# EAGLE schematic Analog_Teil - Kopie (EAGLE 9.3.2)
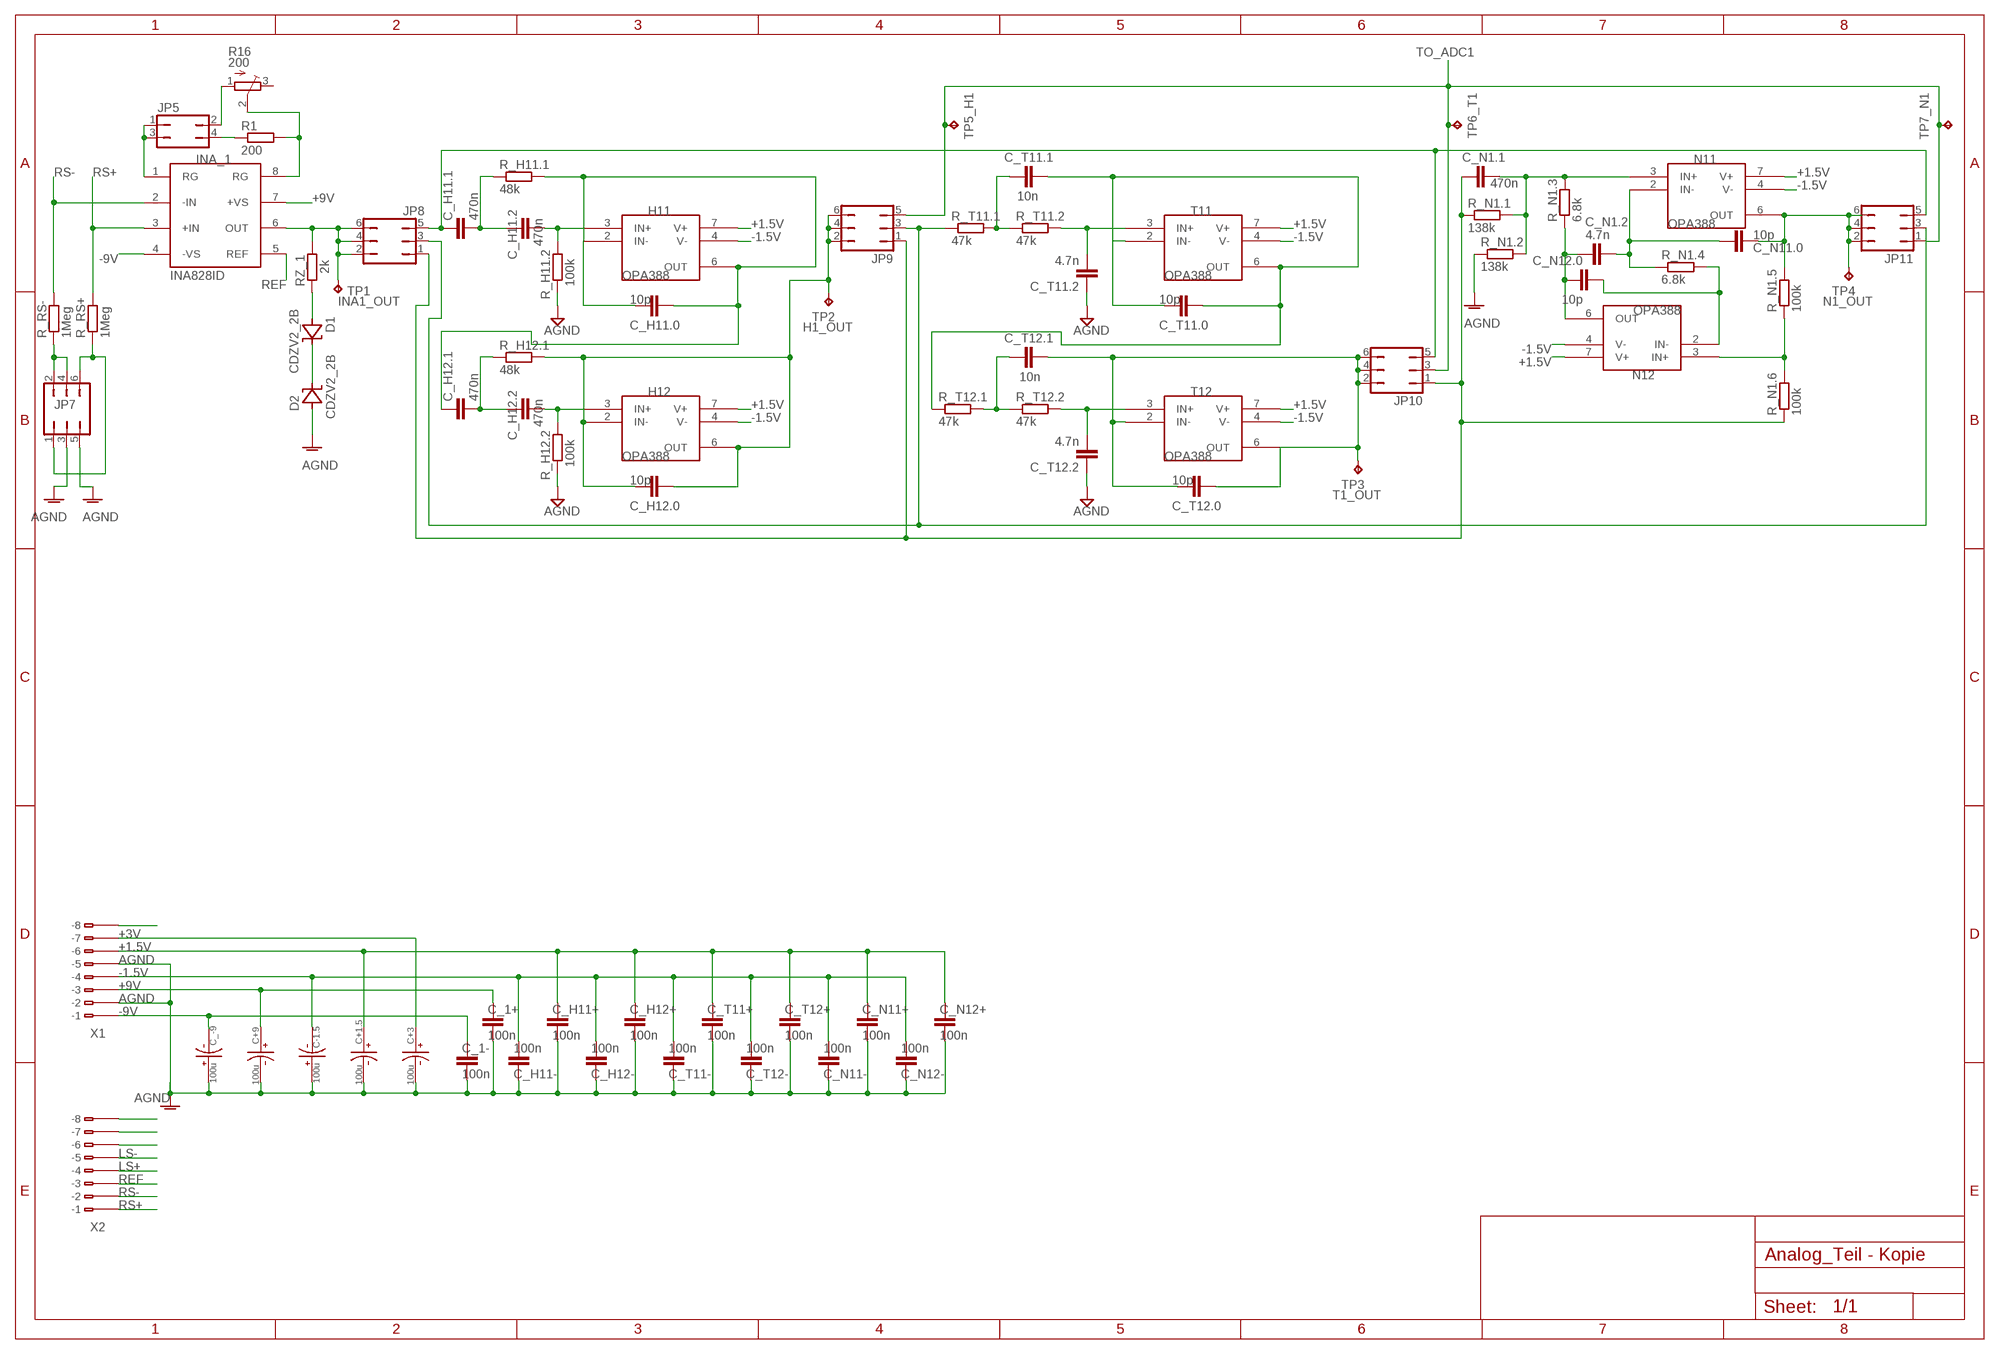
[diagram p0: schematic, sheet 1]

## Parts
C+1.5  100u  ECA-1HM101  [CAPPRD350W60D800H1150B]
C+3  100u  ECA-1HM101  [CAPPRD350W60D800H1150B]
C+9  100u  ECA-1HM101  [CAPPRD350W60D800H1150B]
C-1.5  100u  ECA-1HM101  [CAPPRD350W60D800H1150B]
C_1+  100n  C-EUC0805  [C0805]
C_1-  100n  C-EUC0805  [C0805]
C_-9  100u  ECA-1HM101  [CAPPRD350W60D800H1150B]
C_H11+  100n  C-EUC0805  [C0805]
C_H11-  100n  C-EUC0805  [C0805]
C_H11.0  10p  C-EUC0805  [C0805]
C_H11.1  470n  C-EUC0805  [C0805]
C_H11.2  470n  C-EUC0805  [C0805]
C_H12+  100n  C-EUC0805  [C0805]
C_H12-  100n  C-EUC0805  [C0805]
C_H12.0  10p  C-EUC0805  [C0805]
C_H12.1  470n  C-EUC0805  [C0805]
C_H12.2  470n  C-EUC0805  [C0805]
C_N1.1  470n  C-EUC0805  [C0805]
C_N1.2  4.7n  C-EUC0805  [C0805]
C_N11+  100n  C-EUC0805  [C0805]
C_N11-  100n  C-EUC0805  [C0805]
C_N11.0  10p  C-EUC0805  [C0805]
C_N12+  100n  C-EUC0805  [C0805]
C_N12-  100n  C-EUC0805  [C0805]
C_N12.0  10p  C-EUC0805  [C0805]
C_T11+  100n  C-EUC0805  [C0805]
C_T11-  100n  C-EUC0805  [C0805]
C_T11.0  10p  C-EUC0805  [C0805]
C_T11.1  10n  C-EUC0805  [C0805]
C_T11.2  4.7n  C-EUC0805  [C0805]
C_T12+  100n  C-EUC0805  [C0805]
C_T12-  100n  C-EUC0805  [C0805]
C_T12.0  10p  C-EUC0805  [C0805]
C_T12.1  10n  C-EUC0805  [C0805]
C_T12.2  4.7n  C-EUC0805  [C0805]
D1  CDZV2_2B  CDZV2_2BSOD923  [SODFL1006X40N]
D2  CDZV2_2B  CDZV2_2BSOD923  [SODFL1006X40N]
H11  OPA388  [SOIC127P600X175-8N]
H12  OPA388  [SOIC127P600X175-8N]
INA_1  INA828ID  [SOIC8]
JP5  JP2Q  [JP2Q]
JP7  JP3Q  [JP3Q]
JP8  JP3Q  [JP3Q]
JP9  JP3Q  [JP3Q]
JP10  JP3Q  [JP3Q]
JP11  JP3Q  [JP3Q]
N11  OPA388  [SOIC127P600X175-8N]
N12  OPA388  [SOIC127P600X175-8N]
R1  200  R-EU_R0805  [R0805]
R16  200  TRIM_EU-SM-42/43W  [SM-42/43W]
R_H11.1  48k  R-EU_R0805  [R0805]
R_H11.2  100k  R-EU_R0805  [R0805]
R_H12.1  48k  R-EU_R0805  [R0805]
R_H12.2  100k  R-EU_R0805  [R0805]
R_N1.1  138k  R-EU_R0805  [R0805]
R_N1.2  138k  R-EU_R0805  [R0805]
R_N1.3  6.8k  R-EU_R0805  [R0805]
R_N1.4  6.8k  R-EU_R0805  [R0805]
R_N1.5  100k  R-EU_R0805  [R0805]
R_N1.6  100k  R-EU_R0805  [R0805]
R_RS+  1Meg  R-EU_R0805  [R0805]
R_RS-  1Meg  R-EU_R0805  [R0805]
R_T11.1  47k  R-EU_R0805  [R0805]
R_T11.2  47k  R-EU_R0805  [R0805]
R_T12.1  47k  R-EU_R0805  [R0805]
R_T12.2  47k  R-EU_R0805  [R0805]
RZ_1  2k  R-EU_R0805  [R0805]
T11  OPA388  [SOIC127P600X175-8N]
T12  OPA388  [SOIC127P600X175-8N]
TP1  TPPAD1-13  [P1-13]
TP2  TPPAD1-13  [P1-13]
TP3  TPPAD1-13  [P1-13]
TP4  TPPAD1-13  [P1-13]
TP5_H1  TPPAD1-13  [P1-13]
TP6_T1  TPPAD1-13  [P1-13]
TP7_N1  TPPAD1-13  [P1-13]
X1  233-108  [233-108]
X2  233-108  [233-108]

## Nets
+1.5V: C+1.5.+ C_H11+.1 C_H12+.1 C_N11+.1 C_N12+.1 C_T11+.1 C_T12+.1 H11.7(V+) H12.7(V+) N11.7(V+) N12.7(V+) T11.7(V+) T12.7(V+) X1.B6(B-6)
+3V: C+3.+ X1.B7(B-7)
+9V: C+9.+ C_1+.1 INA_1.7(+VS) X1.B3(B-3)
-1.5V: C-1.5.- C_H11-.2 C_H12-.2 C_N11-.2 C_N12-.2 C_T11-.2 C_T12-.2 H11.4(V-) H12.4(V-) N11.4(V-) N12.4(V-) T11.4(V-) T12.4(V-) X1.B4(B-4)
-9V: C_1-.1 C_-9.- INA_1.4(-VS) X1.B1(B-1)
AGND: C+1.5.- C+3.- C+9.- C-1.5.+ C_1+.2 C_1-.2 C_-9.+ C_H11+.2 C_H11-.1 C_H12+.2 C_H12-.1 C_N11+.2 C_N11-.1 C_N12+.2 C_N12-.1 C_T11+.2 C_T11-.1 C_T11.2.1 C_T12+.2 C_T12-.1 C_T12.2.1 D2.1(A) JP7.3 JP7.5 R_H11.2.1 R_H12.2.1 R_N1.2.1 X1.B2(B-2) X1.B5(B-5)
H1_OUT: C_H12.0.1 C_H12.0.2 H12.2(IN-) H12.6(OUT) JP9.2 JP9.4 JP9.6 R_H12.1.2 TP2.TP
INA1_OUT: INA_1.6(OUT) JP8.2 JP8.4 JP8.6 RZ_1.2 TP1.TP
LS+: X2.B4(B-4)
LS-: X2.B5(B-5)
N1_OUT: C_N11.0.1 JP11.2 JP11.4 JP11.6 N11.6(OUT) R_N1.5.2 TP4.TP
N$1: INA_1.1(RG) JP5.1 JP5.3
N$2: INA_1.8(RG) R1.2 R16.2(S)
N$3: C_H11.1.2 C_H11.2.1 R_H11.1.1
N$4: C_H11.2.2 H11.3(IN+) R_H11.2.2
N$5: D1.1(A) RZ_1.1
N$6: D1.2(C) D2.2(C)
N$7: C_H12.1.2 C_H12.2.1 R_H12.1.1
N$8: C_H12.2.2 H12.3(IN+) R_H12.2.2
N$9: C_T11.1.1 R_T11.1.2 R_T11.2.1
N$11: C_T11.2.2 R_T11.2.2 T11.3(IN+)
N$12: C_T12.1.1 R_T12.1.2 R_T12.2.1
N$14: C_T12.2.2 R_T12.2.2 T12.3(IN+)
N$16: JP5.4 R1.1
N$17: C_N1.1.2 N11.3(IN+) R_N1.1.2 R_N1.2.2 R_N1.3.2
N$18: C_N1.2.1 C_N12.0.2 N12.6(OUT) R_N1.3.1
N$19: C_N1.2.2 C_N11.0.2 N11.2(IN-) R_N1.4.1
N$20: C_N12.0.1 N12.2(IN-) R_N1.4.2
N$22: N12.3(IN+) R_N1.5.1 R_N1.6.2
N$25: JP7.2 JP7.4 R_RS-.1
N$40: JP5.2 R16.1(A)
N$41: JP7.1 JP7.6 R_RS+.1
N$42: C_H11.1.1 JP8.5 JP10.5 JP11.5
N$45: JP8.3 JP9.3 JP11.3 R_T11.1.1
N$47: C_H11.0.1 C_H11.0.2 C_H12.1.1 H11.2(IN-) H11.6(OUT) R_H11.1.2
N$49: C_N1.1.1 JP8.1 JP9.1 JP10.1 R_N1.1.1 R_N1.6.1
N$53: C_T11.0.1 C_T11.0.2 C_T11.1.2 R_T12.1.1 T11.2(IN-) T11.6(OUT)
N$54: X2.B6(B-6)
N$55: X1.B8(B-8)
N$56: X2.B7(B-7)
N$57: X2.B8(B-8)
REF: INA_1.5(REF) X2.B3(B-3)
RS+: INA_1.3(+IN) R_RS+.2 X2.B1(B-1)
RS-: INA_1.2(-IN) R_RS-.2 X2.B2(B-2)
T1_OUT: C_T12.0.1 C_T12.0.2 C_T12.1.2 JP10.2 JP10.4 JP10.6 T12.2(IN-) T12.6(OUT) TP3.TP
TO_ADC1: JP9.5 JP10.3 JP11.1 TP5_H1.TP TP6_T1.TP TP7_N1.TP
Unconnected: H11.1(NC1) H11.5(NC2) H11.8(NC3) H12.1(NC1) H12.5(NC2) H12.8(NC3) N11.1(NC1) N11.5(NC2) N11.8(NC3) N12.1(NC1) N12.5(NC2) N12.8(NC3) R16.3(E) T11.1(NC1) T11.5(NC2) T11.8(NC3) T12.1(NC1) T12.5(NC2) T12.8(NC3) X1.A1(-1) X1.A2(-2) X1.A3(-3) X1.A4(-4) X1.A5(-5) X1.A6(-6) X1.A7(-7) X1.A8(-8) X2.A1(-1) X2.A2(-2) X2.A3(-3) X2.A4(-4) X2.A5(-5) X2.A6(-6) X2.A7(-7) X2.A8(-8)

## Library data of the parts
C+1.5 C+3 C+9 C-1.5 C_-9 = ECA-1HM101:ECA-1HM101: Cap Aluminum Lytic 100uF 50V 20% (8 X 11.5mm) Radial 3.5mm 250mA 2000h 85Â°C Bulk; AVAILABILITY: Unavailable; DESCRIPTION: Electrolytic capacitor Radial lead 3.5 mm 100 µF 50 V 20 % _Ø x L_ 8 mm x 11.5 mm Panasonic ECA1HM101 1 pc_s_; MF: Panasonic Electronic; MP: ECA1HM101; PACKAGE: Radial Panasonic; PRICE: None
C_1+ C_1- C_H11+ C_H11- C_H11.0 C_H11.1 C_H11.2 C_H12+ C_H12- C_H12.0 C_H12.1 C_H12.2 C_N1.1 C_N1.2 C_N11+ C_N11- C_N11.0 C_N12+ C_N12- C_N12.0 C_T11+ C_T11- C_T11.0 C_T11.1 C_T11.2 C_T12+ C_T12- C_T12.0 C_T12.1 C_T12.2 = rcl:C-EU: CAPACITOR, European symbol; SPICEPREFIX: C
D1 D2 = cdzv2_2b:CDZV2_2B
H11 H12 N11 N12 T11 T12 = OPA388:OPA388
INA_1 = INA828ID:INA828ID; DESCRIPTION: 50-μV Offset, 7-nV/√Hz Noise, Low-Power, Precision Instrumentation Amplifier 8-SOIC -40 to 125; DIGI-KEY_PART_NUMBER: 296-47415-ND; DIGI-KEY_PURCHASE_URL: https://www.digikey.com/product-detail/en/texas-instruments/INA828ID/296-47415-ND/7695275?utm_source=snapeda&utm_medium=aggregator&utm_campaign=symbol; MF: Texas Instruments; MP: INA828ID; PACKAGE: SOIC-8 Texas Instruments
JP5 = jumper:JP2Q: JUMPER
JP7-JP11 = jumper:JP3Q: JUMPER
R1 R_H11.1 R_H11.2 R_H12.1 R_H12.2 R_N1.1-R_N1.6 R_RS+ R_RS- R_T11.1 R_T11.2 R_T12.1 R_T12.2 RZ_1 = rcl:R-EU_: RESISTOR, European symbol; SPICEPREFIX: R
R16 = pot:TRIM_EU-: POTENTIOMETER; SPICEPREFIX: J
TP1-TP4 TP5_H1 TP6_T1 TP7_N1 = testpad:TP: Test pad
X1 X2 = con-wago:233-108: WAGO Cage Clamp; MPN: 233-108; OC_FARNELL: unknown; OC_NEWARK: 28K9050